# Altium schematic sheet pixracer_fmu.SchDoc
size A4; SheetNumber: 1; SheetTotal: 5
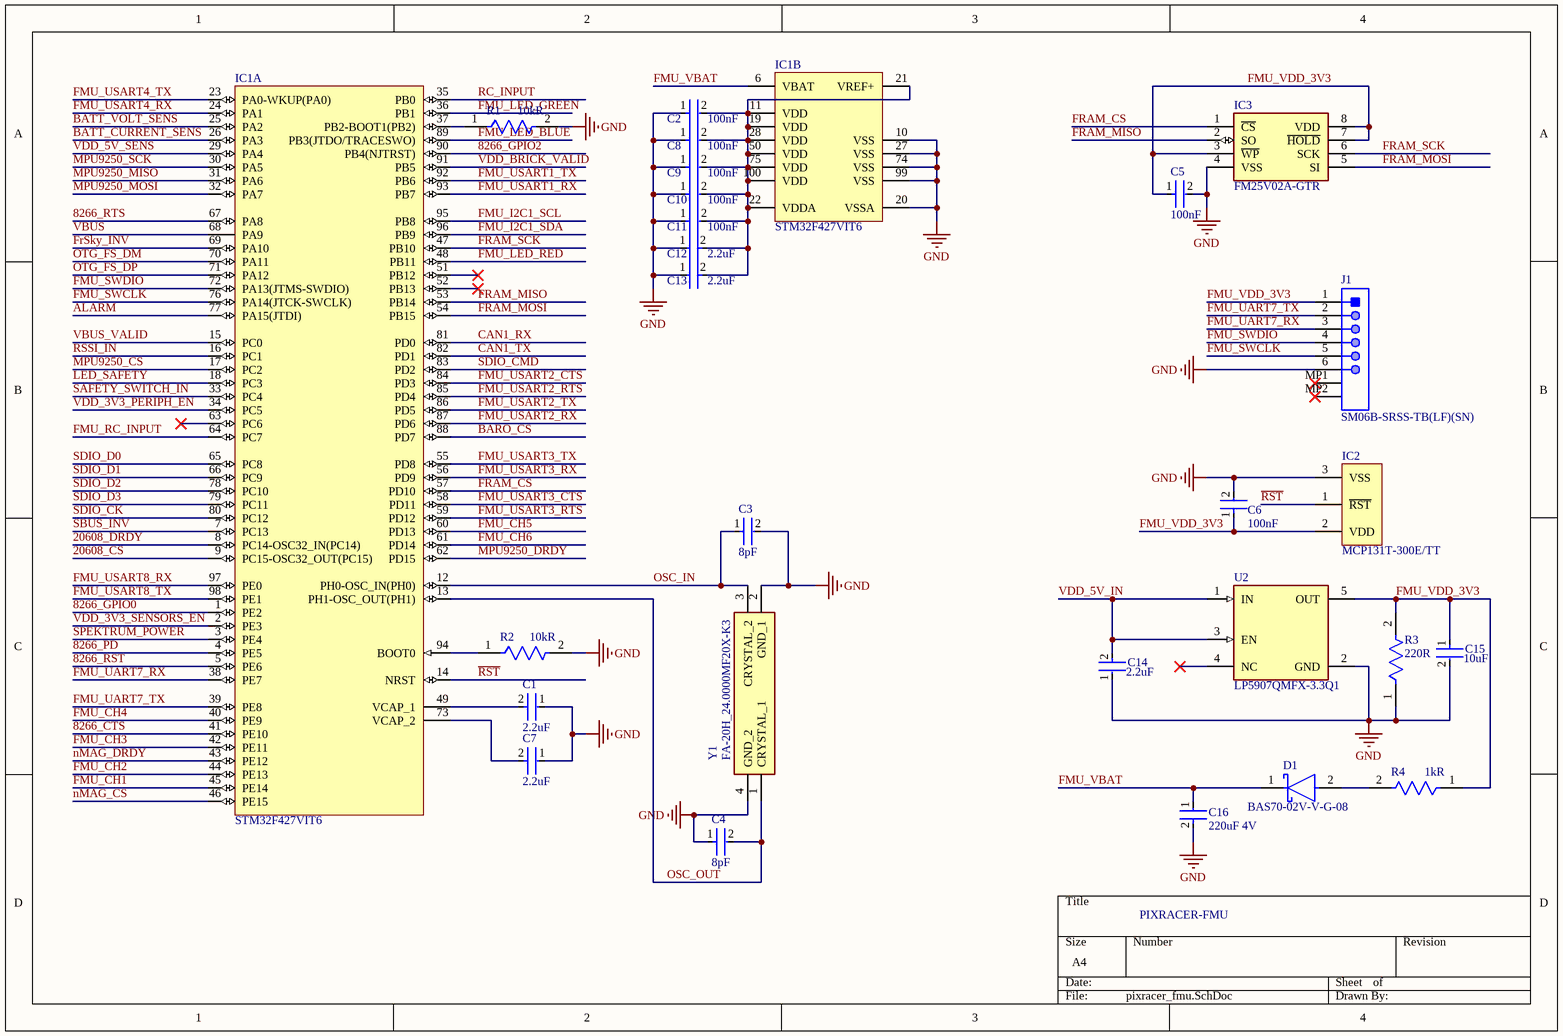
[diagram p0: pixracer_fmu.SchDoc]

## Parts
C1  Capacitance: 2.2uF  [FP-C1608-080-0_1-MFG]  (hidden comment: C1608X7R1A225K080AC)
C2  Capacitance: 100nF  [FP-0603-L_1_6_0_15-W_0_81-IPC_B]  (hidden comment: 0603ZC104MAT2A)
C3  Capacitance: 8pF  [FP-CGA3E-0_3-0_1-IPC_A]  (hidden comment: CGA3E2C0G1H080D080AA)
C4  Capacitance: 8pF  [FP-CGA3E-0_3-0_1-IPC_A]  (hidden comment: CGA3E2C0G1H080D080AA)
C5  Capacitance: 100nF  [FP-0603-L_1_6_0_15-W_0_81-IPC_B]  (hidden comment: 0603ZC104MAT2A)
C6  Capacitance: 100nF  [FP-0603-L_1_6_0_15-W_0_81-IPC_B]  (hidden comment: 0603ZC104MAT2A)
C7  Capacitance: 2.2uF  [FP-C1608-080-0_1-MFG]  (hidden comment: C1608X7R1A225K080AC)
C8  Capacitance: 100nF  [FP-0603-L_1_6_0_15-W_0_81-IPC_B]  (hidden comment: 0603ZC104MAT2A)
C9  Capacitance: 100nF  [FP-0603-L_1_6_0_15-W_0_81-IPC_B]  (hidden comment: 0603ZC104MAT2A)
C10  Capacitance: 100nF  [FP-0603-L_1_6_0_15-W_0_81-IPC_B]  (hidden comment: 0603ZC104MAT2A)
C11  Capacitance: 100nF  [FP-0603-L_1_6_0_15-W_0_81-IPC_B]  (hidden comment: 0603ZC104MAT2A)
C12  Capacitance: 2.2uF  [FP-C1608-080-0_1-MFG]  (hidden comment: C1608X7R1A225K080AC)
C13  Capacitance: 2.2uF  [FP-C1608-080-0_1-MFG]  (hidden comment: C1608X7R1A225K080AC)
C14  Capacitance: 2.2uF  [FP-C1608-080-0_1-MFG]  (hidden comment: C1608X7R1A225K080AC)
C15  Capacitance: 10uF  [FP-CL10-IPC_B]  (hidden comment: CL10A106KP8NNND)
C16  Capacitance: 220uF 4V  [FP-GRM31C-0_3-e0_3_0_9-IPC_C]  (hidden comment: GRM31CR60G227ME11L)
D1  BAS70-02V-V-G-08  [FP-S8-V-3880_02-001-MFG]
IC1  STM32F427VIT6  [STM-LQFP100_N]  (parts A,B of 2)
IC2  MCP131T-300E/TT  [SOT-23-TT3_N]
IC3  FM25V02A-GTR  [SOIC127P602X173-8N]
J1  SM06B-SRSS-TB(LF)(SN)  [JST-SM06B-SRSS-TB_V]
R1  Resistance: 10kR  [FP-ERJ3G-IPC_C]  (hidden comment: ERJ-3GEYJ103V)
R2  Resistance: 10kR  [FP-ERJ3G-IPC_C]  (hidden comment: ERJ-3GEYJ103V)
R3  Resistance: 220R  [FP-CRCW0603-e3-MFG]  (hidden comment: CRCW0603220RFKEB)
R4  Resistance: 1kR  [FP-RC1608-IPC_A]  (hidden comment: RC1608J102CS)
U2  LP5907QMFX-3.3Q1  [FP-DBV0005A-MFG]
Y1  FA-20H_24.0000MF20X-K3  [FA20H160000MF12ZAC3]

## Nets
GND: C1.1 C2.1 C3.2 C4.1 C5.2 C6.2 C7.1 C8.1 C9.1 C10.1 C11.1 C12.1 C13.1 C14.1 C15.2 C16.2 IC1.10(VSS) IC1.20(VSSA) IC1.27(VSS) IC1.74(VSS) IC1.99(VSS) IC2.3(VSS) IC3.4(VSS) J1.6 R1.2 R2.2 R3.1 U2.2(GND) Y1.2(GND_1) Y1.4(GND_2)
8266_CTS: IC1.41(PE10)
8266_GPIO0: IC1.1(PE2)
8266_GPIO2: IC1.90(PB4(NJTRST))
8266_PD: IC1.4(PE5)
8266_RST: IC1.5(PE6)
8266_RTS: IC1.67(PA8)
20608_CS: IC1.9(PC15-OSC32_OUT(PC15))
20608_DRDY: IC1.8(PC14-OSC32_IN(PC14))
~{RST}: IC1.14(NRST) IC2.1(~{RST})
ALARM: IC1.77(PA15(JTDI))
BARO_CS: IC1.88(PD7)
BATT_CURRENT_SENS: IC1.26(PA3)
BATT_VOLT_SENS: IC1.25(PA2)
CAN1_RX: IC1.81(PD0)
CAN1_TX: IC1.82(PD1)
FMU_CH1: IC1.45(PE14)
FMU_CH2: IC1.44(PE13)
FMU_CH3: IC1.42(PE11)
FMU_CH4: IC1.40(PE9)
FMU_CH5: IC1.60(PD13)
FMU_CH6: IC1.61(PD14)
FMU_I2C1_SCL: IC1.95(PB8)
FMU_I2C1_SDA: IC1.96(PB9)
FMU_LED_BLUE: IC1.89(PB3(JTDO/TRACESWO))
FMU_LED_GREEN: IC1.36(PB1)
FMU_LED_RED: IC1.48(PB11)
FMU_RC_INPUT: IC1.64(PC7)
FMU_SWCLK: IC1.76(PA14(JTCK-SWCLK)) J1.5
FMU_SWDIO: IC1.72(PA13(JTMS-SWDIO)) J1.4
FMU_UART7_RX: IC1.38(PE7) J1.3
FMU_UART7_TX: IC1.39(PE8) J1.2
FMU_USART1_RX: IC1.93(PB7)
FMU_USART1_TX: IC1.92(PB6)
FMU_USART2_CTS: IC1.84(PD3)
FMU_USART2_RTS: IC1.85(PD4)
FMU_USART2_RX: IC1.87(PD6)
FMU_USART2_TX: IC1.86(PD5)
FMU_USART3_CTS: IC1.58(PD11)
FMU_USART3_RTS: IC1.59(PD12)
FMU_USART3_RX: IC1.56(PD9)
FMU_USART3_TX: IC1.55(PD8)
FMU_USART4_RX: IC1.24(PA1)
FMU_USART4_TX: IC1.23(PA0-WKUP(PA0))
FMU_USART8_RX: IC1.97(PE0)
FMU_USART8_TX: IC1.98(PE1)
FMU_VBAT: C16.1 D1.1(C) IC1.6(VBAT)
FMU_VDD_3V3: C5.1 C6.1 C15.1 IC2.2(VDD) IC3.3(~{WP}) IC3.7(~{HOLD}) IC3.8(VDD) J1.1 R3.2 R4.1 U2.5(OUT)
FRAM_CS: IC1.57(PD10) IC3.1(~{CS})
FRAM_MISO: IC1.53(PB14) IC3.2(SO)
FRAM_MOSI: IC1.54(PB15) IC3.5(SI)
FRAM_SCK: IC1.47(PB10) IC3.6(SCK)
FrSky_INV: IC1.69(PA10)
LED_SAFETY: IC1.18(PC3)
MPU9250_CS: IC1.17(PC2)
MPU9250_DRDY: IC1.62(PD15)
MPU9250_MISO: IC1.31(PA6)
MPU9250_MOSI: IC1.32(PA7)
MPU9250_SCK: IC1.30(PA5)
nMAG_CS: IC1.46(PE15)
nMAG_DRDY: IC1.43(PE12)
OSC_IN: C3.1 IC1.12(PH0-OSC_IN(PH0)) Y1.3(CRYSTAL_2)
OSC_OUT: C4.2 IC1.13(PH1-OSC_OUT(PH1)) Y1.1(CRYSTAL_1)
OTG_FS_DM: IC1.70(PA11)
OTG_FS_DP: IC1.71(PA12)
RC_INPUT: IC1.35(PB0)
RSSI_IN: IC1.16(PC1)
SAFETY_SWITCH_IN: IC1.33(PC4)
SBUS_INV: IC1.7(PC13)
SDIO_CK: IC1.80(PC12)
SDIO_CMD: IC1.83(PD2)
SDIO_D0: IC1.65(PC8)
SDIO_D1: IC1.66(PC9)
SDIO_D2: IC1.78(PC10)
SDIO_D3: IC1.79(PC11)
SPEKTRUM_POWER: IC1.3(PE4)
VBUS: IC1.68(PA9)
VBUS_VALID: IC1.15(PC0)
VDD_3V3_PERIPH_EN: IC1.34(PC5)
VDD_3V3_SENSORS_EN: IC1.2(PE3)
VDD_5V_IN: C14.2 U2.1(IN) U2.3(EN)
VDD_5V_SENS: IC1.29(PA4)
VDD_BRICK_VALID: IC1.91(PB5)
NetC1_2: C1.2 IC1.49(VCAP_1)
NetC2_2: C2.2 C8.2 C9.2 C10.2 C11.2 C12.2 C13.2 IC1.11(VDD) IC1.19(VDD) IC1.21(VREF+) IC1.22(VDDA) IC1.28(VDD) IC1.50(VDD) IC1.75(VDD) IC1.100(VDD)
NetC7_2: C7.2 IC1.73(VCAP_2)
NetD1_2: D1.2(A) R4.2
NetIC1_37: IC1.37(PB2-BOOT1(PB2)) R1.1
NetIC1_94: IC1.94(BOOT0) R2.1

Not connected (* = marked no-connect by the designer): IC1 51(PB12)* 52(PB13)* 63(PC6)*; J1 MP1* MP2*; U2 4(NC)*

## Notes on the sheet
- PIXRACER-FMU

## Library data of the parts
C1 C7 C12-C14 = CMP-08246-006835-1: Multilayer Ceramic Capacitors 2.2μF ±10% 10V X7R SMD 0603; Lead Free: Lead Free; Mount: Surface Mount; Case Code (Metric): 1608; Construction: Flat; Packaging: Tape and Reel; REACH SVHC: No SVHC; Weight: 7.1E-05oz; Resistor Type: Ceramic; Package Quantity: 4000; Voltage Rating (DC): 10V; Case/Package: 0603; Termination: SMD/SMT; Case Code (Imperial): 0603; Series: C; Voltage Rating: 10V; Min Operating Temperature: -55°C; Dielectric Material: Ceramic; Length: 1.6mm; Tolerance: 10%; Depth: 0.8mm; Width: 0.031inch; Dielectric: X7R; Max Operating Temperature: 125°C; RoHS Compliant: Yes; Height: 0.8mm; Thickness: 0.037inch
C2 C5 C6 C8-C11 = CMP-2006-04550-2: General Purpose Ceramic Capacitor, 0603, 100nF, 20%, X7R, 15%, 10V; Mount: Surface Mount; Package Quantity: 4000; RoHS Compliant: Yes; Case Code (Imperial): 0603; Voltage Rating: 10V; Packaging: Tape and Reel; Series: -; Tolerance: 20%; Thickness: 0.035inch; Number of Pins: 2; Min Operating Temperature: -55°C; Case/Package: 0603; Length: 1.6mm; Radiation Hardening: No; Voltage Rating (DC): 10V; Depth: 0.81mm; Lead Pitch: 0.014inch; Termination: SMD/SMT; Case Code (Metric): 1608; Construction: Flat; Width: 0.032inch; Lead Free: Lead Free; Max Operating Temperature: 125°C; Dielectric: X7R
C3 C4 = CMP-08246-000516-1: Cap Ceramic 8pF 50V C0G 0.5pF Pad SMD 0603 +125°C Automotive T/R; Length: 1.6mm; Max Operating Temperature: 125°C; Voltage Rating: 50V; Depth: 0.8mm; Height: 0.8mm; Composition: Ceramic; Package Quantity: 4000; Thickness: 0.035inch; Packaging: Tape and Reel; Weight: 7.1E-05oz; Mount: Surface Mount; Ratings: AEC-Q200; Width: 0.031inch; Voltage Rating (DC): 50V; Termination: SMD/SMT; Case Code (Metric): 1608; Case Code (Imperial): 0603; Min Operating Temperature: -55°C; Dielectric: C0G; Case/Package: 0603; Radiation Hardening: No; REACH SVHC: No SVHC
C15 = CMP-13271-003245-1: Cap Ceramic 10uF 10V X5R ±10% Pad SMD 0603 +85°C T/R; Packaging: Tape and Reel; Dielectric: X5R; Min Operating Temperature: -55°C; Lead Free: Lead Free; Height: 0.8mm; Package Quantity: 10000; Voltage Rating (DC): 10V; Mount: Surface Mount; Tolerance: 10%; Width: 0.031inch; Thickness: 0.035inch; Depth: 0.8mm; Max Operating Temperature: 85°C; Case/Package: 0603; Length: 1.6mm; Voltage Rating: 10V; Radiation Hardening: No
C16 = CMP-06035-014715-1: Chip Multilayer Ceramic Capacitors for General Purpose, 1206, 220uF, X5R, 15%, 20%, 4V; Termination: SMD/SMT; Length: 0.126inch; Weight: 0.001411oz; Lead Free: Lead Free; Packaging: Tape and Reel; Voltage Rating: 4V; Dielectric: X5R; Voltage Rating (DC): 4V; Case Code (Metric): 3216; REACH SVHC: No SVHC; Mount: Surface Mount; Tolerance: 20%; Height: 1.6mm; Case Code (Imperial): 1206; Package Quantity: 2000; Width: 1.6mm; Thickness: 0.075inch; Case/Package: 1206; Max Operating Temperature: 85°C; Min Operating Temperature: -55°C
D1 = CMP-02539-000029-1: DIODE SCHOTTKY 70V 100MA SOD523; Manufacturer: Vishay; Peak Reverse Current: 0.02uA; Max Junction Temp: +125°C; Max Surge Forward Current: 600mA; Value: 1.5pF; Device Class L3: Schottky Diodes; Reverse Voltage: 70V; ComponentLink2URL: https://www.vishay.com/docs/82393/bas7002v.pdf; Device Class L2: Diodes; Max Repetitive Reverse Voltage: 70V; Forward Current: 100mA; Category: Diode; Temperature Range High: +125°C; Lead Free: Yes; ComponentLink2Description: Datasheet; Octopart: https://octopart.com/bas70-02v-v-g-08-vishay-44351226; Package: S8-V-3880.02-001; RoHS: TRUE; Mouser Description: Schottky Diodes & Rectifiers SCHOTTKY DIODE, PLASTIC; Ipc Land Pattern Name: SODFL16080X60; Capacitance: 1.5pF; Temperature: to +125°C; Device Class L1: Discrete Semiconductors; Height: 0.7mm; Manufacturer Part Number: BAS70-02V-V-G-08; Digikey Description: DIODE SCHOTTKY 70V 100MA SOD523; Automotive: No
IC1 = CMP-0243-00027-2: ARM Cortex-M4 32-bit MCU+FPU, 210 DMIPS, 2048 kB Flash, 256 kB Internal RAM, 82 I/Os, 100-pin LQFP, -40 to 85 degC, Tray; Manufacturer: STMicroelectronics; D/A Converter: 2x12-bit; FLASH Size (Prog) (kB): 2048; I/Os (High Current): 82; Internal RAM Size (kB): 256; Supply Voltage(Vcc) min (V): 1.8; Supply Voltage(Vcc) max (V): 3.6; Operating Frequency(F) (Processor speed) (MHz): 168; Core: ARM Cortex-M4; Mounting Technology: Surface Mount; ComponentLink1URL: http://www.st.com/web/en/home.html; ComponentLink3Description: Package Specification; DatasheetVersion: Rev. 1; ComponentLink3URL: http://www.st.com/st-web-ui/static/active/en/resource/technical/document/data_brief/DM00071938.pdf; ComponentLink2Description: Datasheet; PartNumber: STM32F427VIT6; PackageReference: LQFP100; PackageVersion: Rev. 1, 06/2013; ComponentLink1Description: Manufacturer URL; ComponentLink2URL: http://www.st.com/st-web-ui/static/active/en/resource/technical/document/datasheet/DM00071990.pdf; Packing: Tray; PackageDescription: 100-Pin Low Profile Quad Flat Package, 14 x 14 mm Body, 0.5 mm Pitch
IC2 = CMP-0138-00370-1: Micropower Voltage Supervisors, 3-Pin SOT-23, Extended Temperature, Tape and Reel; Code_IPC: SOT23-3; DatasheetVersion: revB, Mar-2005; PackageReference: SOT-23-TT3; PackageVersion: revBB, Aug-2009; PackageDescription: 3-Lead Plastic Small Outline Transistor (TT) [SOT-23]
IC3 = FM25V02A-GTR: Integrated Circuit; Manufacturer_Name: Cypress Semiconductor; Datasheet Link: https://www.cypress.com/file/139666/download; Height: 1.727mm; Manufacturer_Part_Number: FM25V02A-GTR; Mouser Part Number: 727-FM25V02A-GTR; Mouser Price/Stock: https://www.mouser.co.uk/ProductDetail/Cypress-Semiconductor/FM25V02A-GTR?qs=ILgNtqsyH21Sja70fv%2FiBQ%3D%3D; Arrow Part Number: FM25V02A-GTR; Arrow Price/Stock: https://www.arrow.com/en/products/fm25v02a-gtr/cypress-semiconductor?region=nac
J1 = CMP-2000-07080-1: Male Header, Pitch 1 mm, 1 x 6 Position, Height 2.95 mm, -25 to 85 degC, RoHS, Tape and Reel; Manufacturer: JST; No of Positions: 6; Pitch: 1mm; Style/Orientation: RightAngleHeader/Plug; Datasheet URL: https://datasheet.ciiva.com/26894/getdatasheetpartid-708885-26894671.pdf; Package Description: Male Header, Pitch 1 mm, 1 X 6 Position, Height 2.9 mm; Termination: Solder; Manufacturer URL: http://www.jst.com/home2.html; Type: ShroudedHeader; Package Reference: SM06B-SRSS-TB; Datasheet Version: 11/2010; Mounting Technology: SurfaceMount
R1 R2 = CMP-2000-00704-2: RES SMD 10K OHM 5% 1/10W 0603; Temperature Coefficient: 200ppm/°C; Max Power Dissipation: 100mW; Voltage Rating (DC): 50V; Voltage Rating: 75V; Resistor Type: Thick Film; Tolerance: 5%; Military Standard: Not; Package Quantity: 1; Max Operating Temperature: 155°C; Mount: Surface Mount; Technology: THICK FILM; Case/Package: 0603; Construction: Rectangular; Depth: 0.8mm; Case Code (Imperial): 0603; Weight: 7.1E-05oz; Features: Automotive AEC-Q200; Packaging: Tape and Reel; Width: 0.8mm; Length: 1.6mm; Termination: SMD/SMT; Power Rating: 100mW; Lead Free: Lead Free; Number of Terminations: 2; Height: 0.45mm; RoHS Compliant: Yes; Min Operating Temperature: -55°C; Contact Plating: Tin; REACH SVHC: No SVHC; Resistance Tolerance: 5%; Series: ERJ; Working Voltage: 75V; Case Code (Metric): 1608
R3 = CMP-02407-003555-1: RES Thick Film, 220Ω, 1%, 0.1W, 100ppm/°C, 0603; Voltage Rating: 75V; Power Rating: 100mW; Length: 1.55mm; Weight: 7.1E-05oz; Package Quantity: 10000; Case/Package: 0603; Composition: Thick Film; Max Operating Temperature: 155°C; Military Standard: Not; Tolerance: 1%; Lead Free: Lead Free; Number of Terminations: 2; Min Operating Temperature: -55°C; Case Code (Imperial): 0603; Max Power Dissipation: 100mW; Features: Automotive AEC-Q200; Packaging: Tape and Reel; Temperature Coefficient: 100ppm/°C; Case Code (Metric): 1608; Termination: SMD/SMT; Depth: 0.85mm; Height: 0.02inch; Width: 0.85mm
R4 = CMP-13261-002301-1: Res Thick Film 0603 1kΩ 5% 0.1W ±100ppm/°C Molded SMD T/R; Power Rating: 100mW; Voltage Rating (DC): 50V; Contact Plating: Tin; Mount: Surface Mount; Number of Terminations: 2; Features: Moisture Resistant; Max Power Dissipation: 100mW; Military Standard: Not; Case/Package: 0603; Radiation Hardening: No; Temperature Coefficient: 100ppm/°C; Length: 1.6mm; Height: 0.022inch; Case Code (Metric): 1608; Max Operating Temperature: 155°C; Composition: Thick Film; Tolerance: 5%; Width: 0.031inch; Depth: 0.8mm; Packaging: Tape and Reel; Lead Free: Lead Free; Case Code (Imperial): 0603; Min Operating Temperature: -55°C
U2 = CMP-04917-000018-1: IC REG LINEAR 3.3V 250MA SOT23-5; Manufacturer: Texas Instruments; Number Of Outputs: 1; Dropout Voltage: 120mV; Max Junction Temp: +125°C; Output Type: Fixed; Standoff Height: 0mm; Min Supply Voltage: 2.2V; Max Supply Voltage: 5.5V; Nominal Supply Current: 12-250uA; Automotive Grade: Grade 1; Output Voltage: 3.3V; Height: 1.45mm; Category: IC; Output Current: 250mA; Automotive: Yes; Device Class L3: Voltage Regulators - Linear; Temperature Range Low: -40°C; Device Class L1: Integrated Circuits (ICs); Temperature Range High: +125°C; Octopart: https://octopart.com/lp5907qmfx-3.3q1-texas+instruments-50417899; Lead Free: Yes; Device Class L2: Power Management ICs; Manufacturer Part Number: LP5907QMFX-3.3Q1; Mouser Description: Automotive 250-mA ultra-low-noise low-IQ low-dropout (LDO) linear regulator 5-SOT-23 -40 to 125; ComponentLink2Description: Datasheet; Digikey Description: IC REG LINEAR 3.3V 250MA SOT23-5; Temperature: -40°C to +125°C; Package: DBV0005A; ComponentLink2URL: http://www.ti.com/lit/ds/symlink/lp5907-q1.pdf; RoHS: TRUE
Y1 = FA-20H_24.0000MF20X-K3: Crystal or Oscillator; Manufacturer_Name: Epson Timing; Manufacturer_Part_Number: FA-20H 24.0000MF20X-K3; Datasheet Link: https://support.epson.biz/td/api/doc_check.php?dl=brief_FA-20H&lang=en; Height: 0.55mm; Mouser Part Number: 732-FA20H-24F20X-K3; Mouser Price/Stock: https://www.mouser.co.uk/ProductDetail/Epson-Timing/FA-20H-240000MF20X-K3?qs=CANAagUtPAp2w31393daZQ%3D%3D